# Altium schematic sheet read_out.SchDoc
size A4; SheetNumber: 1; SheetTotal: 5
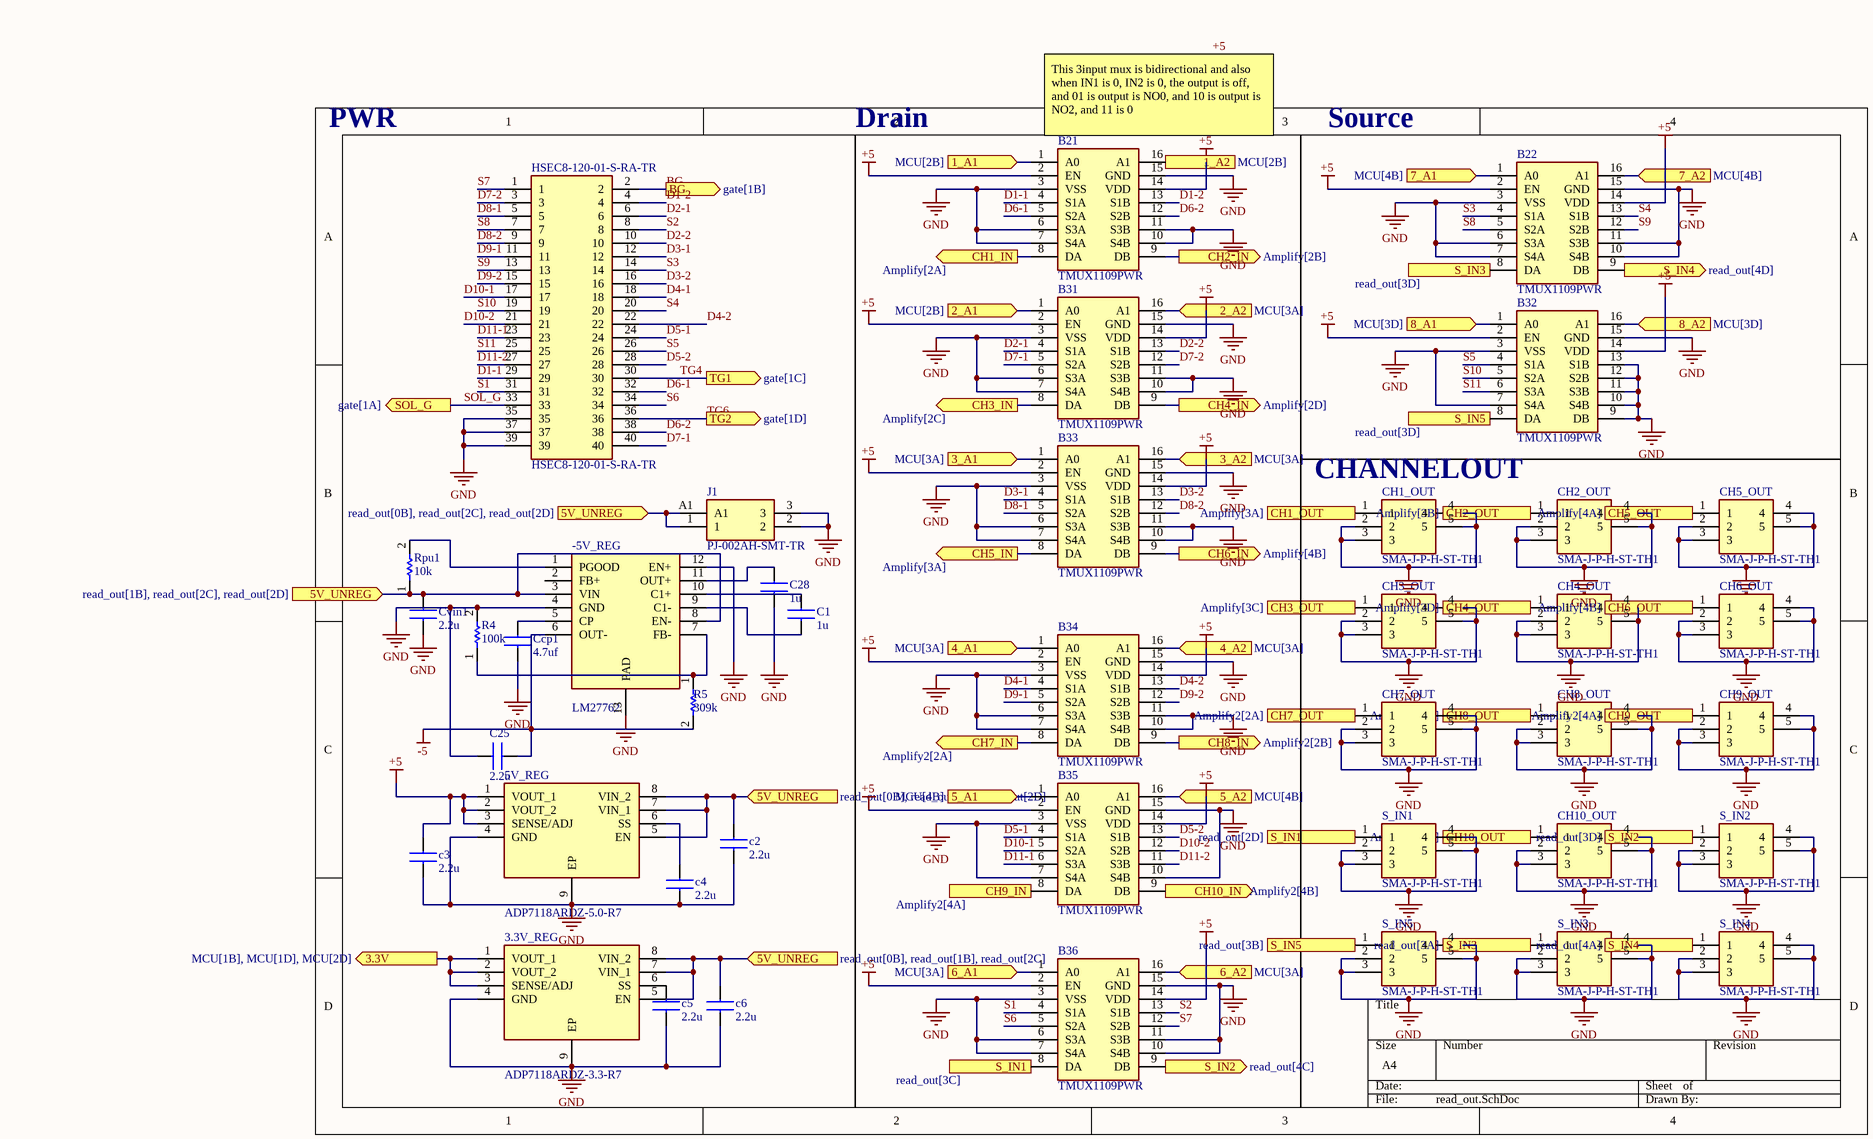
[diagram p0: read_out.SchDoc]

## Parts
3.3V_REG  ADP7118ARDZ-3.3-R7  [ADP7118ARDZ-5.0-R7]
5V_REG  ADP7118ARDZ-5.0-R7  [ADP7118ARDZ-5.0-R7]
-5V_REG  LM27762  [LM27762]
B21  TMUX1109PWR  [TMUX1109PWR]
B22  TMUX1109PWR  [TMUX1109PWR]
B31  TMUX1109PWR  [TMUX1109PWR]
B32  TMUX1109PWR  [TMUX1109PWR]
B33  TMUX1109PWR  [TMUX1109PWR]
B34  TMUX1109PWR  [TMUX1109PWR]
B35  TMUX1109PWR  [TMUX1109PWR]
B36  TMUX1109PWR  [TMUX1109PWR]
C1  1u  [0805X7R106KT1AT]
c2  2.2u  [0805X7R106KT1AT]
c3  2.2u  [0805X7R106KT1AT]
c4  2.2u  [0805X7R106KT1AT]
c5  2.2u  [0805X7R106KT1AT]
c6  2.2u  [0805X7R106KT1AT]
C25  2.2u  [0805X7R106KT1AT]
C28  1u  [0805X7R106KT1AT]
Ccp1  4.7uf  [0805X7R106KT1AT]
CH1_OUT  SMA-J-P-H-ST-TH1  [SMAJPHSTTH1]
CH2_OUT  SMA-J-P-H-ST-TH1  [SMAJPHSTTH1]
CH3_OUT  SMA-J-P-H-ST-TH1  [SMAJPHSTTH1]
CH4_OUT  SMA-J-P-H-ST-TH1  [SMAJPHSTTH1]
CH5_OUT  SMA-J-P-H-ST-TH1  [SMAJPHSTTH1]
CH6_OUT  SMA-J-P-H-ST-TH1  [SMAJPHSTTH1]
CH7_OUT  SMA-J-P-H-ST-TH1  [SMAJPHSTTH1]
CH8_OUT  SMA-J-P-H-ST-TH1  [SMAJPHSTTH1]
CH9_OUT  SMA-J-P-H-ST-TH1  [SMAJPHSTTH1]
CH10_OUT  SMA-J-P-H-ST-TH1  [SMAJPHSTTH1]
Cvin1  2.2u  [0805X7R106KT1AT]
HSEC8-120-01-S-RA-TR  HSEC8-120-01-S-RA-TR  [SAMTEC_HSEC8-120-01-L-RA]
J1  PJ-002AH-SMT-TR  [PWRPJ]
R4  100k  [CR0805-FX-1543ELF]
R5  309k  [CR0805-FX-1543ELF]
Rpu1  10k  [CR0805-FX-1543ELF]
S_IN1  SMA-J-P-H-ST-TH1  [SMAJPHSTTH1]
S_IN2  SMA-J-P-H-ST-TH1  [SMAJPHSTTH1]
S_IN3  SMA-J-P-H-ST-TH1  [SMAJPHSTTH1]
S_IN4  SMA-J-P-H-ST-TH1  [SMAJPHSTTH1]
S_IN5  SMA-J-P-H-ST-TH1  [SMAJPHSTTH1]

## Ports
1_A1 (in, see MCU[2B]), 1_A2 (in, see MCU[2B]), 2_A1 (in, see MCU[2B]), 2_A2 (in, see MCU[3A]), 3.3V (out, see MCU[1B], MCU[1D], MCU[2D]), 3_A1 (in, see MCU[3A]), 3_A2 (in, see MCU[3A]), 4_A1 (in, see MCU[3A]), 4_A2 (in, see MCU[3A]), 5_A1 (in, see MCU[4B]), 5_A2 (in, see MCU[4B]), 5V_UNREG (in, see read_out[0B], read_out[1B], read_out[2C]), 5V_UNREG (in, see read_out[0B], read_out[1B], read_out[2D]), 5V_UNREG (in, see read_out[0B], read_out[2C], read_out[2D]), 5V_UNREG (in, see read_out[1B], read_out[2C], read_out[2D]), 6_A1 (in, see MCU[3A]), 6_A2 (in, see MCU[3A]), 7_A1 (in, see MCU[4B]), 7_A2 (in, see MCU[4B]), 8_A1 (in, see MCU[3D]), 8_A2 (in, see MCU[3D]), BG (out, see gate[1B]), CH1_IN (out, see Amplify[2A]), CH1_OUT (out, see Amplify[3A]), CH2_IN (out, see Amplify[2B]), CH2_OUT (out, see Amplify[3B]), CH3_IN (out, see Amplify[2C]), CH3_OUT (out, see Amplify[3C]), CH4_IN (out, see Amplify[2D]), CH4_OUT (out, see Amplify[3D]), CH5_IN (out, see Amplify[3A]), CH5_OUT (out, see Amplify[4A]), CH6_IN (out, see Amplify[4B]), CH6_OUT (out, see Amplify[4B]), CH7_IN (out, see Amplify2[2A]), CH7_OUT (out, see Amplify2[2A]), CH8_IN (out, see Amplify2[2B]), CH8_OUT (out, see Amplify2[3B]), CH9_IN (out, see Amplify2[4A]), CH9_OUT (out, see Amplify2[4A]), CH10_IN (out, see Amplify2[4B]), CH10_OUT (out, see Amplify2[5B]), S_IN1 (in, see read_out[2D]), S_IN1 (out, see read_out[3C]), S_IN2 (in, see read_out[3D]), S_IN2 (out, see read_out[4C]), S_IN3 (in, see read_out[3A]), S_IN3 (out, see read_out[3D]), S_IN4 (in, see read_out[4A]), S_IN4 (out, see read_out[4D]), S_IN5 (in, see read_out[3B]), S_IN5 (out, see read_out[3D]), SOL_G (out, see gate[1A]), TG1 (out, see gate[1C]), TG2 (out, see gate[1D])

## Nets
+5: 5V_REG.1(VOUT_1) 5V_REG.2(VOUT_2) 5V_REG.3(SENSE/ADJ) B21.2(EN) B21.14(VDD) B22.2(EN) B22.14(VDD) B31.2(EN) B31.14(VDD) B32.2(EN) B32.14(VDD) B33.2(EN) B33.14(VDD) B34.2(EN) B34.14(VDD) B35.2(EN) B35.14(VDD) B36.2(EN) B36.14(VDD) c3.2
-5: -5V_REG.6(OUT-) C25.1 R5.2
GND: 3.3V_REG.4(GND) 3.3V_REG.9(EP) 5V_REG.4(GND) 5V_REG.9(EP) -5V_REG.4(GND) -5V_REG.12(EN+) -5V_REG.13(PAD) B21.3(VSS) B21.6(S3A) B21.7(S4A) B21.10(S4B) B21.11(S3B) B21.15(GND) B22.3(VSS) B22.6(S3A) B22.7(S4A) B22.10(S4B) B22.11(S3B) B22.15(GND) B31.3(VSS) B31.6(S3A) B31.7(S4A) B31.10(S4B) B31.11(S3B) B31.15(GND) B32.3(VSS) B32.7(S4A) B32.9(DB) B32.10(S4B) B32.11(S3B) B32.12(S2B) B32.13(S1B) B32.15(GND) B33.3(VSS) B33.6(S3A) B33.7(S4A) B33.10(S4B) B33.11(S3B) B33.15(GND) B34.3(VSS) B34.6(S3A) B34.7(S4A) B34.10(S4B) B34.11(S3B) B34.15(GND) B35.3(VSS) B35.7(S4A) B35.10(S4B) B35.15(GND) B36.3(VSS) B36.6(S3A) B36.7(S4A) B36.10(S4B) B36.11(S3B) B36.15(GND) c2.1 c3.1 c4.1 c5.1 c6.1 C25.2 C28.1 Ccp1.1 CH1_OUT.2 CH1_OUT.3 CH1_OUT.4 CH1_OUT.5 CH2_OUT.2 CH2_OUT.3 CH2_OUT.4 CH2_OUT.5 CH3_OUT.2 CH3_OUT.3 CH3_OUT.4 CH3_OUT.5 CH4_OUT.2 CH4_OUT.3 CH4_OUT.4 CH4_OUT.5 CH5_OUT.2 CH5_OUT.3 CH5_OUT.4 CH5_OUT.5 CH6_OUT.2 CH6_OUT.3 CH6_OUT.4 CH6_OUT.5 CH7_OUT.2 CH7_OUT.3 CH7_OUT.4 CH7_OUT.5 CH8_OUT.2 CH8_OUT.3 CH8_OUT.4 CH8_OUT.5 CH9_OUT.2 CH9_OUT.3 CH9_OUT.4 CH9_OUT.5 CH10_OUT.2 CH10_OUT.3 CH10_OUT.4 CH10_OUT.5 Cvin1.1 HSEC8-120-01-S-RA-TR.35 HSEC8-120-01-S-RA-TR.37 HSEC8-120-01-S-RA-TR.39 J1.2 J1.3 R4.2 S_IN1.2 S_IN1.3 S_IN1.4 S_IN1.5 S_IN2.2 S_IN2.3 S_IN2.4 S_IN2.5 S_IN3.2 S_IN3.3 S_IN3.4 S_IN3.5 S_IN4.2 S_IN4.3 S_IN4.4 S_IN4.5 S_IN5.2 S_IN5.3 S_IN5.4 S_IN5.5
1_A1: B21.1(A0) ; port 1_A1
1_A2: B21.16(A1) ; port 1_A2
2_A1: B31.1(A0) ; port 2_A1
2_A2: B31.16(A1) ; port 2_A2
3.3V: 3.3V_REG.1(VOUT_1) 3.3V_REG.2(VOUT_2) 3.3V_REG.3(SENSE/ADJ) ; port 3.3V
3_A1: B33.1(A0) ; port 3_A1
3_A2: B33.16(A1) ; port 3_A2
4_A1: B34.1(A0) ; port 4_A1
4_A2: B34.16(A1) ; port 4_A2
5_A1: B35.1(A0) ; port 5_A1
5_A2: B35.16(A1) ; port 5_A2
5V_UNREG: 3.3V_REG.5(EN) 3.3V_REG.7(VIN_1) 3.3V_REG.8(VIN_2) 5V_REG.5(EN) 5V_REG.7(VIN_1) 5V_REG.8(VIN_2) -5V_REG.3(VIN) -5V_REG.8(EN-) c2.2 c6.2 Cvin1.2 J1.1 J1.A1 Rpu1.1 ; port 5V_UNREG
6_A1: B36.1(A0) ; port 6_A1
6_A2: B36.16(A1) ; port 6_A2
7_A1: B22.1(A0) ; port 7_A1
7_A2: B22.16(A1) ; port 7_A2
8_A1: B32.1(A0) ; port 8_A1
8_A2: B32.16(A1) ; port 8_A2
BG: HSEC8-120-01-S-RA-TR.2 ; port BG
CH1_IN: B21.8(DA) ; port CH1_IN
CH1_OUT: CH1_OUT.1 ; port CH1_OUT
CH2_IN: B21.9(DB) ; port CH2_IN
CH2_OUT: CH2_OUT.1 ; port CH2_OUT
CH3_IN: B31.8(DA) ; port CH3_IN
CH3_OUT: CH3_OUT.1 ; port CH3_OUT
CH4_IN: B31.9(DB) ; port CH4_IN
CH4_OUT: CH4_OUT.1 ; port CH4_OUT
CH5_IN: B33.8(DA) ; port CH5_IN
CH5_OUT: CH5_OUT.1 ; port CH5_OUT
CH6_IN: B33.9(DB) ; port CH6_IN
CH6_OUT: CH6_OUT.1 ; port CH6_OUT
CH7_IN: B34.8(DA) ; port CH7_IN
CH7_OUT: CH7_OUT.1 ; port CH7_OUT
CH8_IN: B34.9(DB) ; port CH8_IN
CH8_OUT: CH8_OUT.1 ; port CH8_OUT
CH9_IN: B35.8(DA) ; port CH9_IN
CH9_OUT: CH9_OUT.1 ; port CH9_OUT
CH10_IN: B35.9(DB) ; port CH10_IN
CH10_OUT: CH10_OUT.1 ; port CH10_OUT
D1-1: B21.4(S1A) HSEC8-120-01-S-RA-TR.29
D1-2: B21.13(S1B) HSEC8-120-01-S-RA-TR.4
D2-1: B31.4(S1A) HSEC8-120-01-S-RA-TR.6
D2-2: B31.13(S1B) HSEC8-120-01-S-RA-TR.10
D3-1: B33.4(S1A) HSEC8-120-01-S-RA-TR.12
D3-2: B33.13(S1B) HSEC8-120-01-S-RA-TR.16
D4-1: B34.4(S1A) HSEC8-120-01-S-RA-TR.18
D4-2: B34.13(S1B) HSEC8-120-01-S-RA-TR.22
D5-1: B35.4(S1A) HSEC8-120-01-S-RA-TR.24
D5-2: B35.13(S1B) HSEC8-120-01-S-RA-TR.28
D6-1: B21.5(S2A) HSEC8-120-01-S-RA-TR.32
D6-2: B21.12(S2B) HSEC8-120-01-S-RA-TR.38
D7-1: B31.5(S2A) HSEC8-120-01-S-RA-TR.40
D7-2: B31.12(S2B) HSEC8-120-01-S-RA-TR.3
D8-1: B33.5(S2A) HSEC8-120-01-S-RA-TR.5
D8-2: B33.12(S2B) HSEC8-120-01-S-RA-TR.9
D9-1: B34.5(S2A) HSEC8-120-01-S-RA-TR.11
D9-2: B34.12(S2B) HSEC8-120-01-S-RA-TR.15
D10-1: B35.5(S2A) HSEC8-120-01-S-RA-TR.17
D10-2: B35.12(S2B) HSEC8-120-01-S-RA-TR.21
D11-1: B35.6(S3A) HSEC8-120-01-S-RA-TR.23
D11-2: B35.11(S3B) HSEC8-120-01-S-RA-TR.27
S1: B36.4(S1A) HSEC8-120-01-S-RA-TR.31
S2: B36.13(S1B) HSEC8-120-01-S-RA-TR.8
S3: B22.4(S1A) HSEC8-120-01-S-RA-TR.14
S4: B22.13(S1B) HSEC8-120-01-S-RA-TR.20
S5: B32.4(S1A) HSEC8-120-01-S-RA-TR.26
S6: B36.5(S2A) HSEC8-120-01-S-RA-TR.34
S7: B36.12(S2B) HSEC8-120-01-S-RA-TR.1
S8: B22.5(S2A) HSEC8-120-01-S-RA-TR.7
S9: B22.12(S2B) HSEC8-120-01-S-RA-TR.13
S10: B32.5(S2A) HSEC8-120-01-S-RA-TR.19
S11: B32.6(S3A) HSEC8-120-01-S-RA-TR.25
S_IN1: B36.8(DA) S_IN1.1 ; port S_IN1
S_IN2: B36.9(DB) S_IN2.1 ; port S_IN2
S_IN3: B22.8(DA) S_IN3.1 ; port S_IN3
S_IN4: B22.9(DB) S_IN4.1 ; port S_IN4
S_IN5: B32.8(DA) S_IN5.1 ; port S_IN5
SOL_G: HSEC8-120-01-S-RA-TR.33 ; port SOL_G
TG4: HSEC8-120-01-S-RA-TR.30 ; port TG1
TG6: HSEC8-120-01-S-RA-TR.36 ; port TG2
Net3.3V_REG_6: 3.3V_REG.6(SS) c5.2
Net5V_REG_6: 5V_REG.6(SS) c4.2
Net-5V_REG_1: -5V_REG.1(PGOOD) Rpu1.2
Net-5V_REG_5: -5V_REG.5(CP) Ccp1.2
Net-5V_REG_7: -5V_REG.7(FB-) R4.1 R5.1
Net-5V_REG_9: -5V_REG.9(C1-) C1.1
Net-5V_REG_10: -5V_REG.10(C1+) C1.2
Net-5V_REG_11: -5V_REG.11(OUT+) C28.2

Not connected (* = marked no-connect by the designer): -5V_REG 2(FB+)

## Notes on the sheet
- PWR
- Drain
- (near B21) Type @ to refer to a designator or a net
- (near B21) This 3input mux is bidirectional and also when IN1 is 0, IN2 is 0, the output is off, and 01 is output is NO0, and 10 is output is NO2, and 11 is 0
- Source
- (near CH1_OUT) CHANNELOUT
- Labels drawn without touching a wire or pin: +5

## Library data of the parts
3.3V_REG = ADP7118ARDZ-5.0-R7
C1 c2-c6 C25 C28 Ccp1 = capacitor
CH1_OUT CH2_OUT CH3_OUT CH4_OUT CH5_OUT CH6_OUT CH7_OUT CH8_OUT CH9_OUT CH10_OUT S_IN1-S_IN5 = SMA-J-P-H-ST-TH1: SAMTEC - SMA-J-P-H-ST-TH1 - RF COAXIAL, SMA JACK, 50 OHM, PCB; Geometry.Height: 9.55mm; Mouser Part Number: 200-SMAJPHSTTH1; Mouser Price/Stock: https://www.mouser.co.uk/ProductDetail/Samtec/SMA-J-P-H-ST-TH1?qs=bkXRl3BLxbHdaAB2Qwy6zw%3D%3D; Manufacturer_Name: SAMTEC; Manufacturer_Part_Number: SMA-J-P-H-ST-TH1; Datasheet Link: http://suddendocs.samtec.com/prints/sma-j-p-x-st-th1-mkt.pdf
Cvin1 = 0805X7R106KT1AT
J1 = Powerinput
R4 R5 Rpu1 = resistor